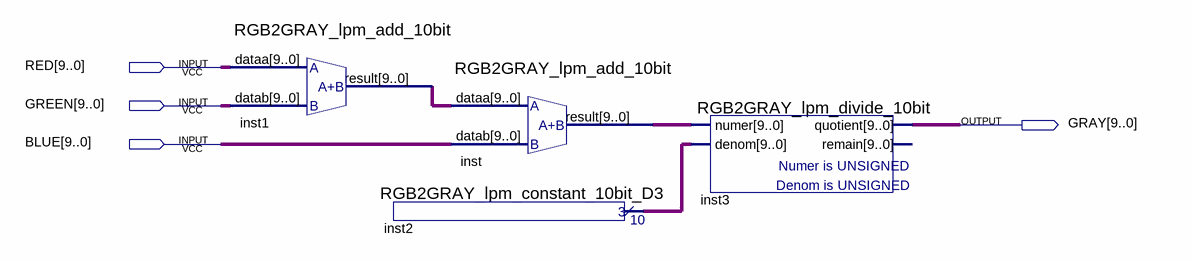
[diagram p0: schematic sheet]
// Quartus schematic RGB2GRAY.bdf as structural Verilog: 4 symbols, 4 pins
module RGB2GRAY (
  input  [9:0] RED,
  input  [9:0] GREEN,
  input  [9:0] BLUE,
  output [9:0] GRAY
);

  wire [9:0] inst1_result, inst2_result, inst_result;

  RGB2GRAY_lpm_add_10bit inst1 (.dataa(RED), .datab(GREEN), .result(inst1_result));
  RGB2GRAY_lpm_constant_10bit_D3 inst2 (.result(inst2_result));
  RGB2GRAY_lpm_add_10bit inst (.dataa(inst1_result), .datab(BLUE), .result(inst_result));
  RGB2GRAY_lpm_divide_10bit inst3 (.numer(inst_result), .denom(inst2_result), .quotient(GRAY));  // open: remain
endmodule
